# Altium schematic sheet POWER.SchDoc
size A4; SheetNumber: 3; SheetTotal: 6
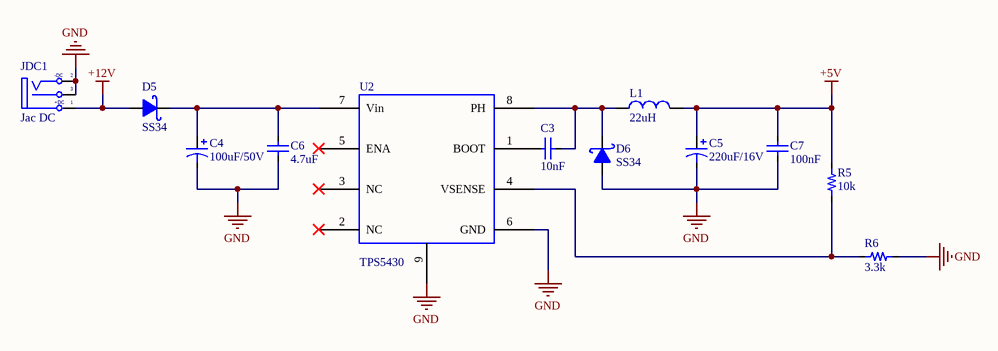
[diagram p0: POWER.SchDoc]

## Parts
C3  10nF  [CAP_0805]
C4  100uF/50V  [C8mm]
C5  220uF/16V  [C5mm]
C6  4.7uF  [CAP_0805]
C7  100nF  [CAP_0805]
D5  SS34  [DIODE SMA]
D6  SS34  [DIODE SMA]
JDC1  Jac DC  [DC-IN]
L1  22uH  [L_SMD]
R5  10k  [RES-SMD-0805]
R6  3.3k  [RES-SMD-0805]
U2  TPS5430  [TPS5430-2]

## Nets
+5V: C5.1 C7.1 L1.2 R5.2
+12V: D5.1(A) JDC1.1(T)
GND: C4.2 C5.2 C6.2 C7.2 D6.1(A) JDC1.2(TN) JDC1.3(S) R6.2 U2.6(GND) U2.9(PWR_PAD)
NetC3_1: C3.1 U2.1(BOOT)
NetC3_2: C3.2 D6.2(K) L1.1 U2.8(PH)
NetC4_1: C4.1 C6.1 D5.2(K) U2.7(Vin)
NetR5_1: R5.1 R6.1 U2.4(VSENSE)

Not connected (* = marked no-connect by the designer): U2 2(NC)* 3(NC)* 5(ENA)*

## Notes on the sheet
- (in symbol DCIN) -DC; +DC

## Library data of the parts
C3 C6 C7 = CapSMD: Capacitor; Value: 33p; Published: 8-Jun-2000; LatestRevisionDate: 17-Jul-2002; LatestRevisionNote: Re-released for DXP Platform.; PackageReference: RAD-0.3; Publisher: Altium Limited
C4 C5 = Cap Pol: Polarized Capacitor (Axial); Published: 8-Jun-2000; LatestRevisionDate: 17-Jul-2002; LatestRevisionNote: Re-released for DXP Platform.; PackageReference: POLAR0.8; Publisher: Altium Limited
D5 D6 = 1N5822: Schottky Rectifiers; Value: Diode c?m 1N5408
JDC1 = DCIN: Jac DC input; Value: Jac DC
L1 = Inductor: CD73R 22uH 1.23A 7345; Value: 150 mH
R5 R6 = Resistor - SMD: Resistor; Manufacturer: Generic Components; Class: Passive; Published: 08/06/2000; Publisher: Altium Hobart Technology Centre
U2 = TPS5430: Name: TPS5430